# EAGLE design Adafruit INA169 CurPowerMonitor (EAGLE 6.3)
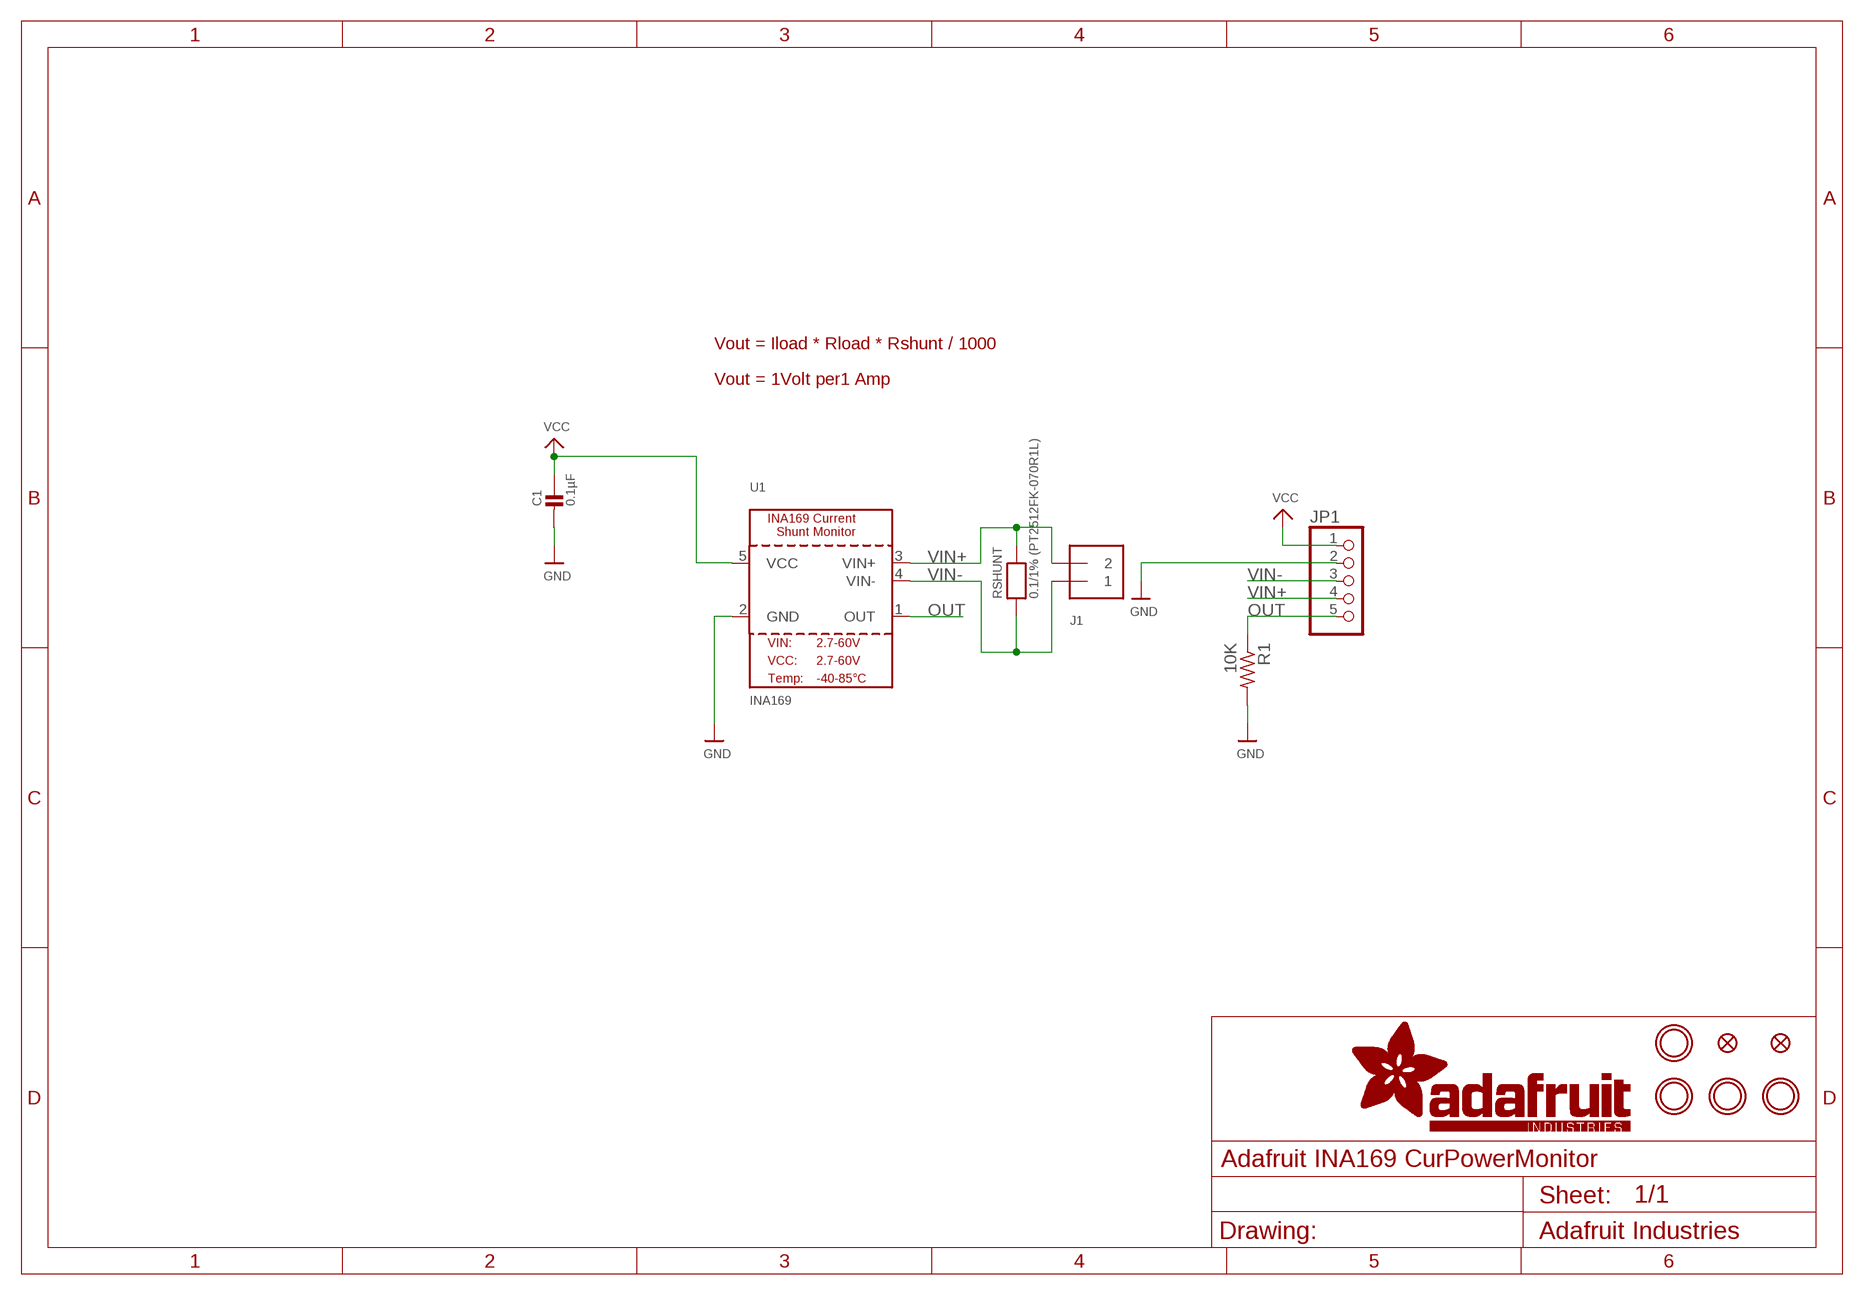
[diagram p0: schematic, sheet 1]

## Parts
C1  0.1µF  CAP_CERAMIC0805  [0805]
FID1  FIDUCIAL""  [FIDUCIAL_1MM]
FID2  FIDUCIAL""  [FIDUCIAL_1MM]
J1  TERMBLOCK_1X2  [TERMBLOCK_1X2-3.5MM]
JP1  HEADER-1X570MIL  [1X05_ROUND_70]
R1  10K  RESISTOR_DUAL  [0805-THM]
RSHUNT  0.1/1% (PT2512FK-070R1L)  RESISTOR2512  [2512]
U1  INA169  [SOT23-5]
U$7  MOUNTINGHOLE2.5  [MOUNTINGHOLE_2.5_PLATED]
U$8  MOUNTINGHOLE2.5  [MOUNTINGHOLE_2.5_PLATED]
U$9  MOUNTINGHOLE2.5  [MOUNTINGHOLE_2.5_PLATED]
U$10  MOUNTINGHOLE2.5  [MOUNTINGHOLE_2.5_PLATED]

## Nets
GND: C1.2 JP1.2 R1.2 U1.2(GND)
OUT: JP1.5 R1.1 U1.1(OUT)
VCC: C1.1 JP1.1 U1.5(VCC)
VIN+: J1.2 JP1.4 RSHUNT.2 U1.3(VIN+)
VIN-: J1.1 JP1.3 RSHUNT.1 U1.4(VIN-)

## Notes on the sheet
- Vout = Iload * Rload * Rshunt / 1000
- Vout = 1Volt per1 Amp

## Library data of the parts
C1 = microbuilder:CAP_CERAMIC: Ceramic Capacitors For new designs, use the packages preceded by an '_' character since they are more reliable: The following footprints should be used on most boards: _0402 - Standard footprint for regular board layouts _0603 - Standard footprint for regular board layouts _0805 - Standard footprint for regular board layouts For extremely tight-pitch boards where space is at a premium, the following 'micro-pitch' footprints can be used (smaller pads, no silkscreen outline, etc.): _0402MP - Micro-pitch footprint for very dense/compact boards _0603MP - Micro-pitch footprint for very dense/compact boards _0805MP - Micro-pitch footprint for very dense/compact boards Commonly Stocked Parts 0402 - 0402 Surface Mount Capacitors 16pF 50V 5% [Digikey: 445-4899-2-ND] 18pF 50V 5% [Digikey: 490-1281-2-ND] 22pF 50V 5% [Digikey: 490-1283-2-ND] 68pF 50V 5% [Digikey: 490-1289-2-ND] 0.1uF 10V 10% [Digikey: 490-1318-2-ND] 1.0uF 6.3V 10% [Digikey: 490-1320-2-ND] 0603 - 0603 Surface Mount Capacitors 16 pF 50V 5% [Digikey: 445-5051-2-ND] 22 pF 50V [Digikey: PCC220ACVTR-ND] 33 pF 50V 5% [Digikey: 490-1415-1-ND] 56pF 50V 5% [Digikey: 490-1421-1-ND] 220pF 50V 5% [Digikey: 445-1285-1-ND] 680 pF 50V 2200 pF 50V 5% C0G [Digikey: 445-1297-1-ND] 5600 pF 100V 5% X7R [Digikey: 478-3711-1-ND] 0.1 µF 25V 10% [Digikey: PCC2277TR-ND] 0.22 µF 16V 10% X7R [Digikey: 445-1318-1-ND] 1.0 µF 25V 10% [Digikey: 445-5146-2-ND] 0603 - RF Specific 3pF 250V +/-0.1pF RF [Digikey: 712-1347-1-ND] 18 pF 250V 5% [Digikey: 478-3505-1-ND or 712-1322-1-ND] 56 pF 250V 5% C0G RF [Digikey: 490-4867-1-ND] 68 pF 250V RF [Digikey: 490-4868-1-ND] 0805 - 0805 Surface Mount Capacitors 220 pF 250V 2% RF Ceramic Capacitor [Digikey: 712-1398-1-ND] 1000 pF 50V 2% NP0 Ceramic Capacitor [Digikey: 478-3760-1-ND] 0.1 µF 25V 10% Ceramic Capacitor [Digikey: PCC1828TR-ND] 1.0 µF 16V 10% Ceramic Capacitor[Digikey: 490-1691-2-ND] 10.0 µF 10V 10% Ceramic Capacitor[Digikey: 709-1228-1-ND] 10.0 uF 16V 10% Ceramic Capacitor [Digikey: 478-5165-2-ND] 47 uF 6.3V 20% Ceramic Capacitor [Digikey: 587-1779-1-ND or 399-5506-1-ND] 1206 - 1206 Surface Mount Capacitors 47uF 10V 20% Ceramic Capacitor [Digikey: 490-5528-1-ND or 399-5508-1-ND or 445-6010-1-ND] 100uF 6.3V -20%, +80% Y5V Ceramic Capacitor (Digikey: 490-4512-1-ND, Mouser: 81-GRM31CF50J107ZE1L)
FID1 FID2 = microbuilder:FIDUCIAL: Fiducial Alignment Points Various fiducial points for machine vision alignment.; BOM: EXCLUDE
J1 = microbuilder:TERMBLOCK_1X2: 3.5mm Terminal block http://www.ladyada.net/library/pcb/eaglelibrary.html
JP1 = microbuilder:HEADER-1X5: PIN HEADER
R1 = microbuilder:RESISTOR_DUAL: Flip Flop resistor An 0805 resistor inside a standard 1/4W 5% resistor. Makes for easy mods Footprint taken from the Adafruit Industries Eagle Library.
RSHUNT = microbuilder:RESISTOR: Resistors For new designs, use the packages preceded by an '_' character since they are more reliable: The following footprints should be used on most boards: _0402 - Standard footprint for regular board layouts _0603 - Standard footprint for regular board layouts _0805 - Standard footprint for regular board layouts For extremely tight-pitch boards where space is at a premium, the following 'micro-pitch' footprints can be used (smaller pads, no silkscreen outline, etc.): _0402MP - Micro-pitch footprint for very dense/compact boards _0603MP - Micro-pitch footprint for very dense/compact boards _0805MP - Micro-pitch footprint for very dense/compact boards
U1 = microbuilder:INA169: INA169 - High-Side Measurement Current Shunt Monitor The device converts a differential input voltage to a current output. This current is converted back to a voltage with an external load resistor that sets any gain from 1 to over 100.
U$7-U$10 = microbuilder:MOUNTINGHOLE: Mounting Hole For #2 screws (0.086"/2.18mm width, 0.094"/2.4mm hole) use 2.5mm

## Board
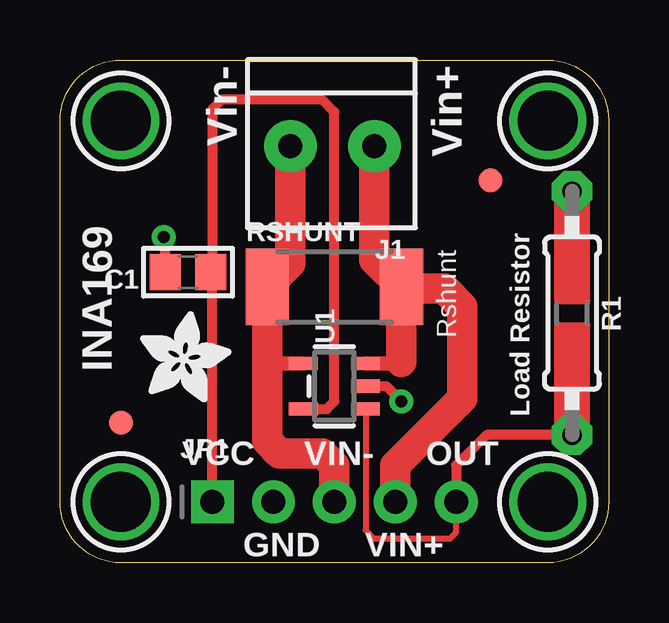
[diagram p1: board, top side]
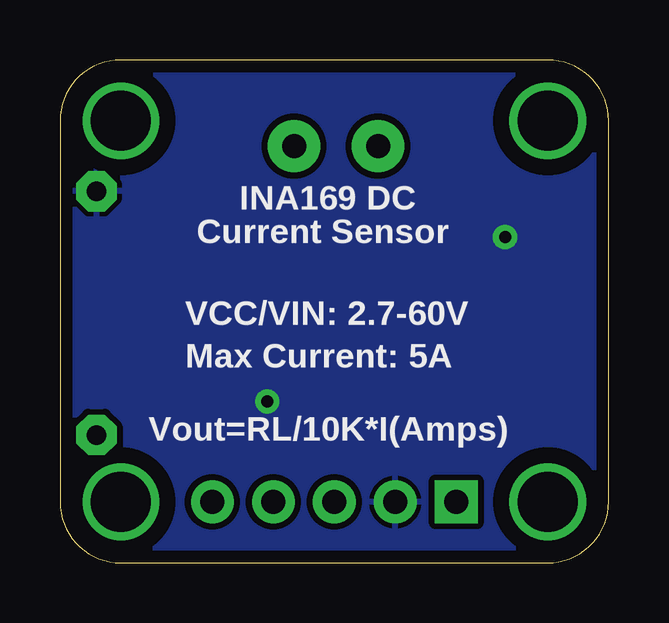
[diagram p2: board, bottom side, seen from below]

Size 22.86 x 20.97 mm. Coordinates in mm from the lower left corner, seen from the top.
Outline: 0,2.54 0,18.43 arc-90 2.54,20.97 20.32,20.97 arc-90 22.86,18.43 22.86,2.54 arc-90 20.32,0 2.54,0 arc-90 0,2.54
Copper layers (1*16): Top 0.035mm / dielectric 1.5mm / Bottom 0.035mm
Design rules "default": minimum track width 8mil, minimum drill 0.4mm, track to track 8mil, track to pad 8mil, pad to pad 8mil, via to via 8mil, smd to smd 8mil, copper to edge 20mil, drill to drill 8mil, minimum pad ring 8mil, minimum via ring 10mil, stop-mask expansion 3mil, vias tented up to drill 20mil, thermal gap 8mil

### Footprints (pad centres in the part's own frame; a part is rotated, then mirrored left to right if it is on the bottom)
0805 = smd 1.3 x 1.5: 1 -0.95,0; 2 0.95,0
FIDUCIAL_1MM = smd 1 x 1: 1 0,0
TERMBLOCK_1X2-3.5MM = drill 1 pad 2.184: 1 1.8,0; 2 -1.7,0
1X05_ROUND_70 = drill 1 pad 1.778 square: 1 -5.08,0 | drill 1 pad 1.778: 2 -2.54,0; 3 0,0; 4 2.54,0; 5 5.08,0
0805-THM = drill 0.813 pad 1.676 octagon: 1 -5.08,0; 2 5.08,0
2512 = smd 1.8 x 3.2: 1 -2.8,0; 2 2.8,0
SOT23-5 = smd 0.55 x 1.2: 1 -0.95,-1.3; 2 0,-1.3; 3 0.95,-1.3; 4 0.95,1.3; 5 -0.95,1.3
MOUNTINGHOLE_2.5_PLATED = drill 2.5 pad 3.2: P$1 0,0

### Placement (x,y rotation side)
C1  5.33,12.12 180 top
FID1  17.93,15.96 0 top
FID2  2.54,5.84 0 top
J1  11.4,17.38 180 top
JP1  11.43,2.54 0 top
R1  21.34,10.41 90 top
RSHUNT  11.43,11.51 0 top
U1  11.43,7.37 90 top
U$7  20.32,2.54 0 top
U$8  2.54,2.54 0 top
U$9  2.54,18.43 0 top
U$10  20.32,18.43 0 top
U$11  [ADAFRUIT_3.5MM]  3.33,6.68 0 top

### Tracks (layer width: path | path; a pad name or v marks a point on that pad's centre or on a via)
GND  (via drill 0.5)
  Top 0.406: U1.2 13.59,7.37 v14.22,6.73 | C1.2 4.38,13.52 v4.32,13.59
  Bottom 0.406: v14.22,6.73 14.48,6.73 | v4.32,13.59 4.32,13.72
  pour Bottom (isolate 0.254): 0,0 0,20.97 22.86,20.97 22.86,0
OUT
  Top 0.254: U1.1 12.73,1.37 13.08,1.02 16.26,1.02 16.51,1.27 JP1.5
  Top 0.406: R1.1 17.78,5.33 16.51,4.06 JP1.5
VCC
  Top 0.406: U1.5 11.12,6.42 11.43,6.73 11.43,18.8 10.92,19.3 6.73,19.3 6.35,18.92 6.35,12.19 C1.1 6.35,12.05 JP1.1
VIN+
  Top 0.61: U1.3 14.16,8.32 14.22,8.38
  Top 1.27: J1.2 13.1,12.64 RSHUNT.2 | JP1.4 13.97,4.06 16.76,6.86 16.76,10.67 16,11.43 14.31,11.43 RSHUNT.2 | 14.22,8.38 RSHUNT.2
VIN-
  Top 0.61: U1.4 8.7,8.32 8.64,8.38
  Top 1.27: J1.1 9.6,12.48 RSHUNT.1 8.64,8.38 | JP1.3 11.43,4.06 10.92,4.57 9.14,4.57 8.64,5.08 8.64,8.25 8.7,8.32

### Text on the board
tPlace: Vin- | Vin+ | Rshunt | INA169 | Load Resistor | VCC | VIN- | OUT | GND | VIN+
bPlace: INA169 DC | Current Sensor | VCC/VIN: 2.7-60V | Max Current: 5A | Vout=RL/10K*I(Amps)